# EasyEDA schematic emb_3y_project_2020-11-04_04-35-24.json
TITLE: Sheet_1; REV: 1.0; Date: 2020-10-28; Sheet: 1/1; Drawn By: Praveen Dhananjaya; Company: Your Company
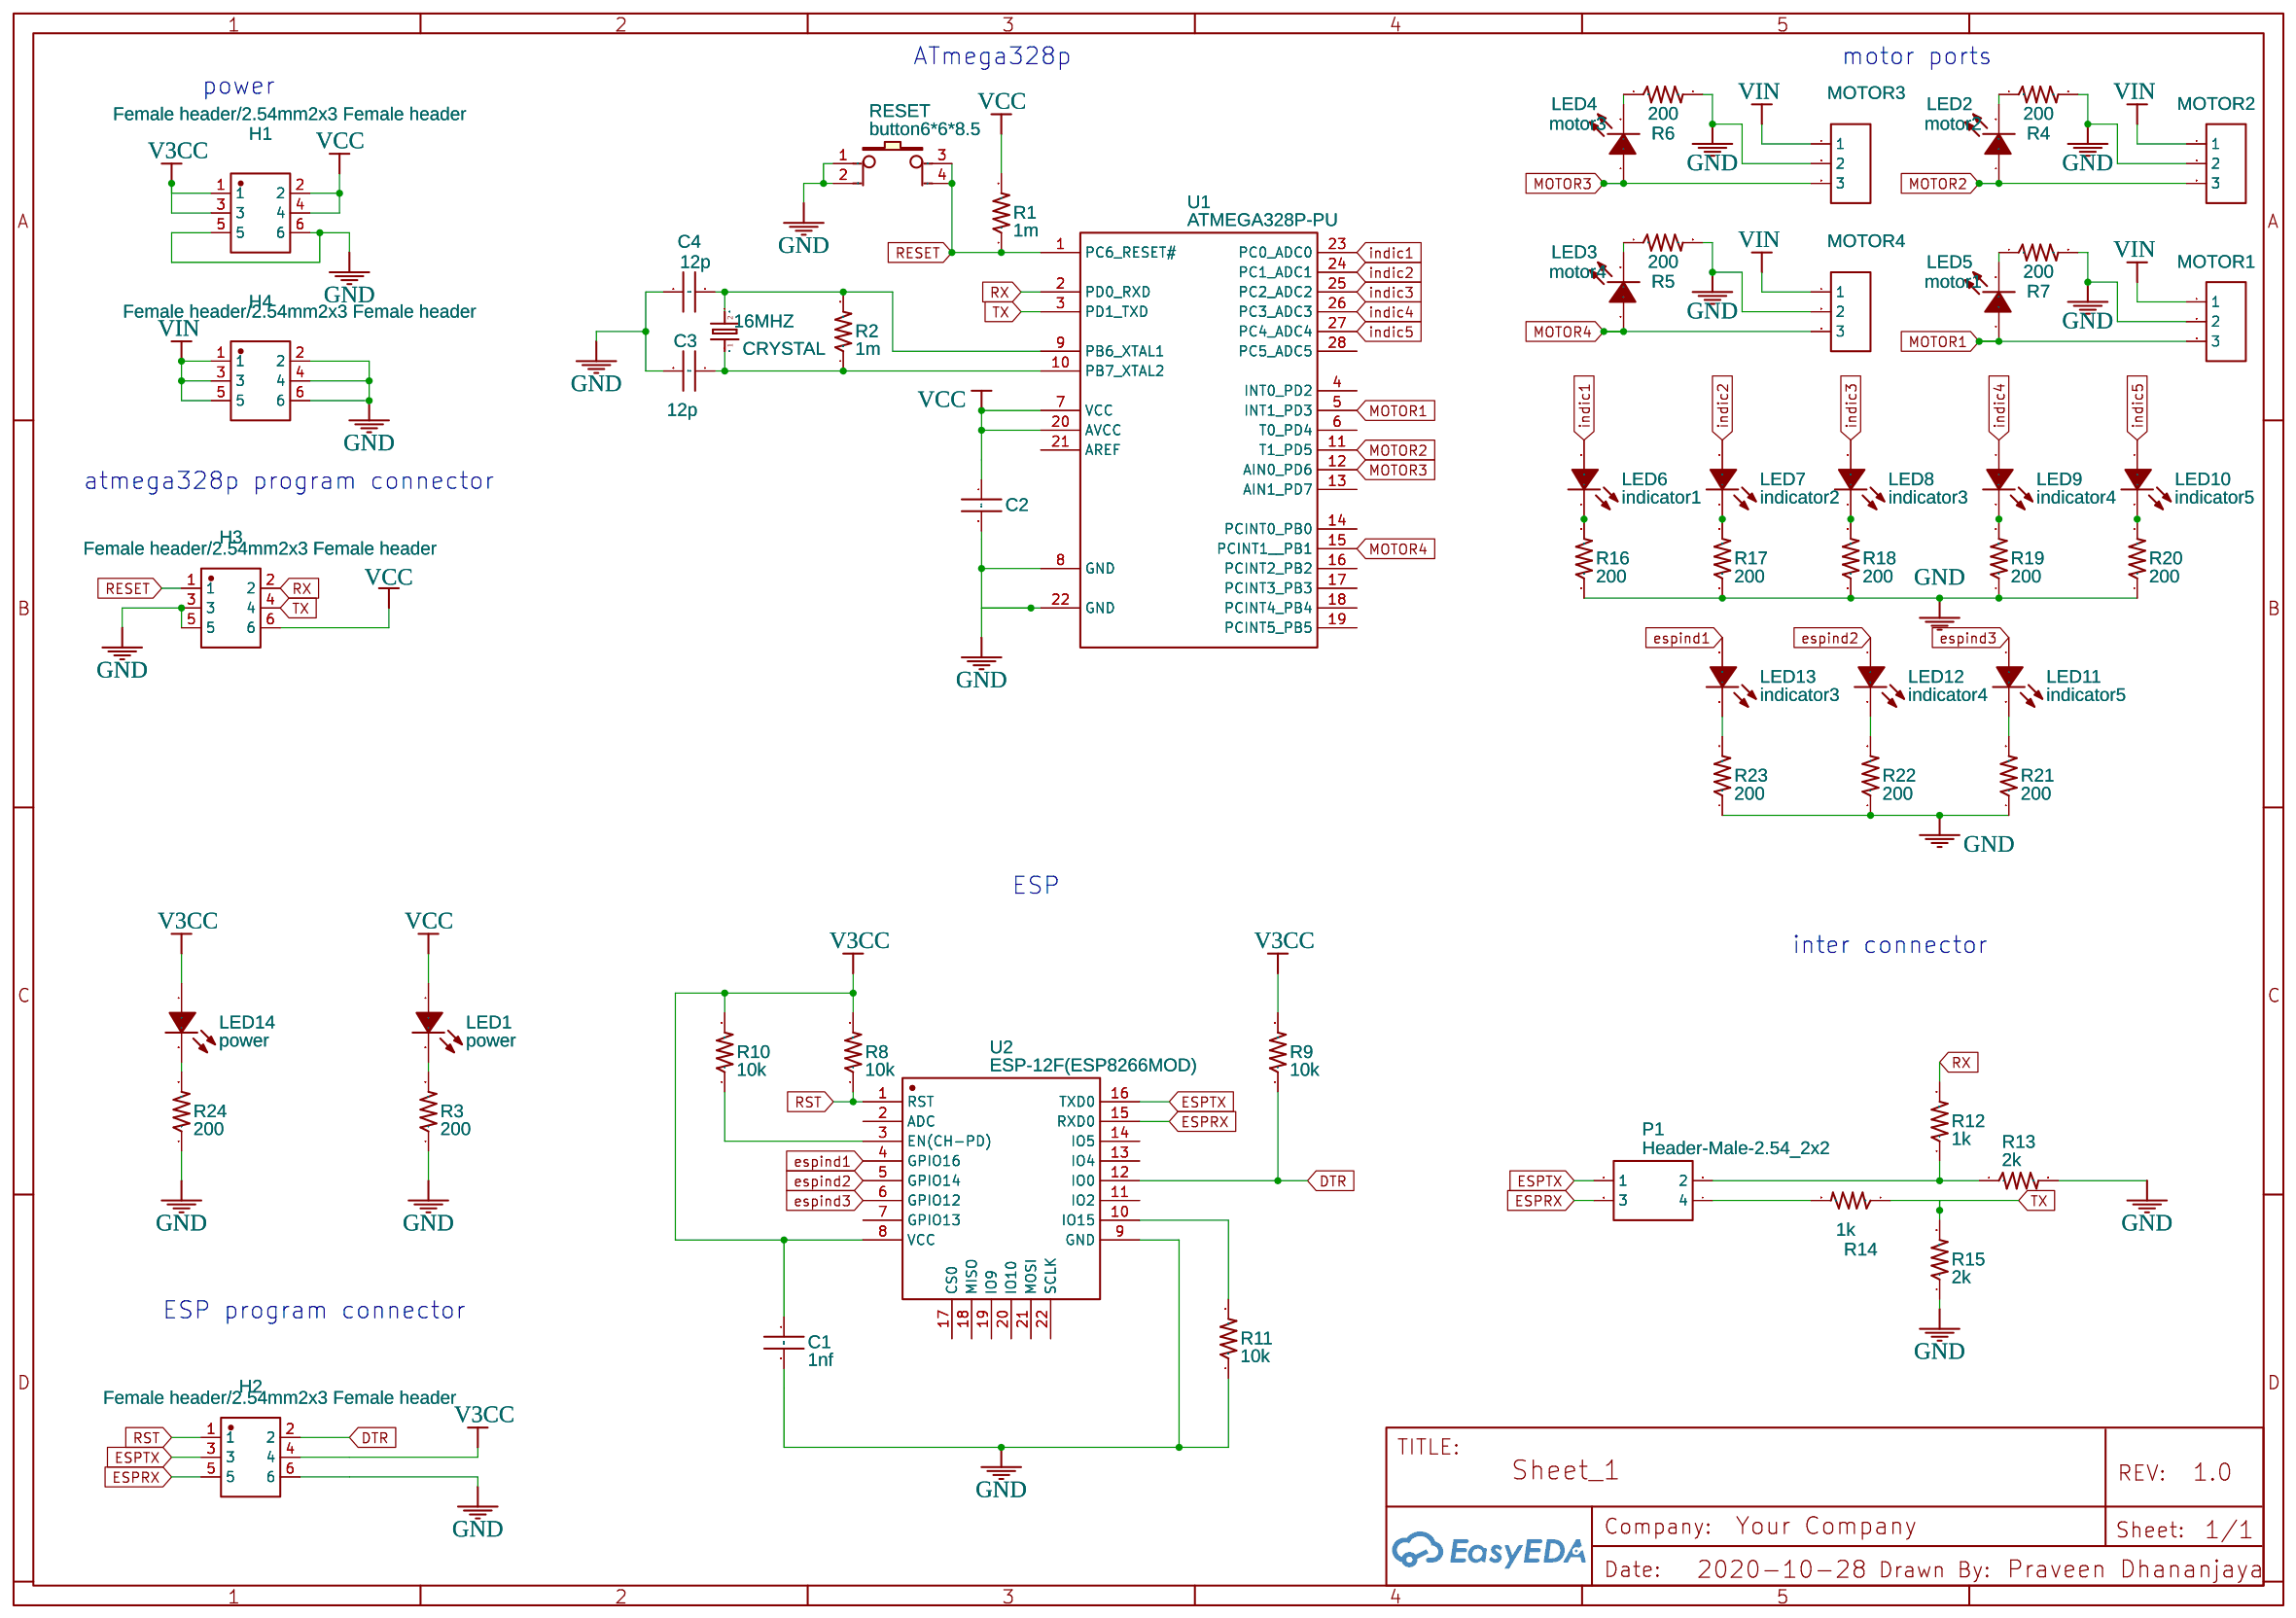
[diagram p0: schematic sheet]

## Parts
16MHZ  CRYSTAL  [HC49US]
C1  1nf  [CAPACITOR (SMT)0805]
C2  12p  [CAPACITOR (SMT)0805]
C3  12p  [CAPACITOR (SMT)0805]
C4  12p  [CAPACITOR (SMT)0805]
H1  Female header/2.54mm2x3 Female header  [HDR-TH_6P-P2.54-V-R2-C3-S2.54]
H2  Female header/2.54mm2x3 Female header  [HDR-TH_6P-P2.54-V-R2-C3-S2.54]
H3  Female header/2.54mm2x3 Female header  [HDR-TH_6P-P2.54-V-R2-C3-S2.54]
H4  Female header/2.54mm2x3 Female header  [HDR-TH_6P-P2.54-V-R2-C3-S2.54]
LED1  power  [LED-TH_BD3.8-P2.54-FD]
LED2  motor2  [LED-TH_BD3.8-P2.54-FD]
LED3  motor4  [LED-TH_BD3.8-P2.54-FD]
LED4  motor3  [LED-TH_BD3.8-P2.54-FD]
LED5  motor1  [LED-TH_BD3.8-P2.54-FD]
LED6  indicator1  [LED-TH_BD3.8-P2.54-FD]
LED7  indicator2  [LED-TH_BD3.8-P2.54-FD]
LED8  indicator3  [LED-TH_BD3.8-P2.54-FD]
LED9  indicator4  [LED-TH_BD3.8-P2.54-FD]
LED10  indicator5  [LED-TH_BD3.8-P2.54-FD]
LED11  indicator5  [LED-TH_BD3.8-P2.54-FD]
LED12  indicator4  [LED-TH_BD3.8-P2.54-FD]
LED13  indicator3  [LED-TH_BD3.8-P2.54-FD]
LED14  power  [LED-TH_BD3.8-P2.54-FD]
MOTOR1  Header-Male-2.54_1x3  [HDR-TH_3P-P2.54-V]
MOTOR2  Header-Male-2.54_1x3  [HDR-TH_3P-P2.54-V]
MOTOR3  Header-Male-2.54_1x3  [HDR-TH_3P-P2.54-V]
MOTOR4  Header-Male-2.54_1x3  [HDR-TH_3P-P2.54-V]
P1  Header-Male-2.54_2x2  [HDR-TH_4P-P2.54-V-R2-C2-S2.54]
R1  1m  [PAK_SMD805]
R2  1m  [PAK_SMD805]
R3  200  [PAK_SMD805]
R4  200  [PAK_SMD805]
R5  200  [PAK_SMD805]
R6  200  [PAK_SMD805]
R7  200  [PAK_SMD805]
R8  10k  [PAK_SMD805]
R9  10k  [PAK_SMD805]
R10  10k  [PAK_SMD805]
R11  10k  [PAK_SMD805]
R12  1k  [PAK_SMD805]
R13  2k  [PAK_SMD805]
R14  1k  [PAK_SMD805]
R15  2k  [PAK_SMD805]
R16  200  [PAK_SMD805]
R17  200  [PAK_SMD805]
R18  200  [PAK_SMD805]
R19  200  [PAK_SMD805]
R20  200  [PAK_SMD805]
R21  200  [PAK_SMD805]
R22  200  [PAK_SMD805]
R23  200  [PAK_SMD805]
R24  200  [PAK_SMD805]
RESET  button6*6*8.5  [KEY-TH_4P-L6.0-W6.0-P4.50]
U1  ATMEGA328P-PU  [DIP-28_L34.6-W7.3-P2.54-LS10.2-BL]
U2  ESP-12F(ESP8266MOD)  [WIFIM-SMD_ESP-12F-ESP8266MOD]

## Library data of the parts
16MHZ = CRYSTAL: Contributor: SparkFun; sourceId: PAyw6e8qI
C1-C4 = CL21C910JBANNNC: Supplier Part: 1276-1836-1-ND; Supplier: Digi-Key; link: http://www.digikey.com/product-detail/en/samsung-electro-mechanics-america-inc/CL21C910JBANNNC/1276-1836-1-ND/3889922; Contributor: thedoctor916
H1-H4 = Female header/2.54mm2x3 Female header: Supplier Part: C47552; Supplier: LCSC; Manufacturer: ReliaPro
LED1-LED14 = LEDOrange orange 3AO4UD: Supplier: LCSC; Manufacturer: KENTO; image: //image.lceda.cn/szlcsc/C62095.jpg; Supplier Part: C62095
MOTOR1-MOTOR4 = Header-Male-2.54_1x3: Supplier: LCSC; Manufacturer: BOOMELE; Manufacturer Part: Header2.54mm 1*3P; image: //image.lceda.cn/szlcsc/C49257.jpg; Supplier Part: C49257
P1 = Header-Male-2.54_2x2: Supplier: LCSC; Manufacturer: BOOMELE; Manufacturer Part: Double Rows2.54mm2*2pHeaders  Pins; Supplier Part: C66690
R1-R24 = R_US805: Manufacturer Part: SAMTECH; link: https://www.mouser.com/ProductDetail/Semtech/TS51224-M000WCSR?qs=sGAEpiMZZMve4%2FbfQkoj%252BOSaK9ndEUJ4S7hJCjD%2FN%252BQ%3D; Contributor: Intector
RESET = button6*6*8.5: Supplier Part: C59980; Supplier: LCSC; Manufacturer: ReliaPro; image: http://image.lceda.cn/szlcsc/C59980.jpg
U1 = ATMEGA328P-PU: sourceId: Oic6oiASL; Supplier: LCSC; Manufacturer: MICROCHIP; image: //image.lceda.cn/szlcsc/C33901.jpg; Contributor: LCSC; Supplier Part: C33901
U2 = ESP-12F(ESP8266MOD): Supplier: LCSC; Manufacturer: Ai-Thinker; Supplier Part: C82891

## Nets
GND: C1.1 C2.2 C3.2 C4.2 H1.5 H1.6 H2.6 H3.3 H3.5 H4.2 H4.4 H4.6 MOTOR1.2 MOTOR2.2 MOTOR3.2 MOTOR4.2 R3.1 R4.2 R5.2 R6.2 R7.2 R11.1 R13.2 R15.1 R16.1 R17.1 R18.1 R19.1 R20.1 R21.1 R22.1 R23.1 R24.1 RESET.1 RESET.2 U1.8(GND) U1.22(GND) U2.9(GND)
V3CC: C1.2 H1.1 H1.3 H2.4 LED14.1(A) R8.2 R9.2 R10.2 U2.8(VCC)
VCC: C2.1 H1.2 H1.4 H3.6 LED1.1(A) R1.2 U1.7(VCC) U1.20(AVCC)
VIN: H4.1 H4.3 H4.5 MOTOR1.1 MOTOR2.1 MOTOR3.1 MOTOR4.1
DTR: H2.2 R9.1 U2.12(IO0)
espind1: LED13.1(A) U2.4(GPIO16)
espind2: LED12.1(A) U2.5(GPIO14)
espind3: LED11.1(A) U2.6(GPIO12)
ESPRX: H2.5 P1.3 U2.15(RXD0)
ESPTX: H2.3 P1.1 U2.16(TXD0)
indic1: LED6.1(A) U1.23(PC0 ADC0)
indic2: LED7.1(A) U1.24(PC1 ADC1)
indic3: LED8.1(A) U1.25(PC2 ADC2)
indic4: LED9.1(A) U1.26(PC3 ADC3)
indic5: LED10.1(A) U1.27(PC4 ADC4)
MOTOR1: LED5.1(A) MOTOR1.3 U1.5(INT1 PD3)
MOTOR2: LED2.1(A) MOTOR2.3 U1.11(T1 PD5)
MOTOR3: LED4.1(A) MOTOR3.3 U1.12(AIN0 PD6)
MOTOR4: LED3.1(A) MOTOR4.3 U1.15(PCINT1  PB1)
RESET: H3.1 R1.1 RESET.3 RESET.4 U1.1(PC6 RESET#)
RST: H2.1 R8.1 U2.1(RST)
RX: H3.2 R12.2 U1.2(PD0 RXD)
TX: H3.4 R14.1 R15.2 U1.3(PD1 TXD)
Net-(16MHZ-1): 16MHZ.1 C3.1 R2.1 U1.10(PB7 XTAL2)
Net-(16MHZ-2): 16MHZ.2 C4.1 R2.2 U1.9(PB6 XTAL1)
Net-(LED1-2): LED1.2(K) R3.2
Net-(LED2-2): LED2.2(K) R4.1
Net-(LED3-2): LED3.2(K) R5.1
Net-(LED4-2): LED4.2(K) R6.1
Net-(LED5-2): LED5.2(K) R7.1
Net-(LED6-2): LED6.2(K) R16.2
Net-(LED7-2): LED7.2(K) R17.2
Net-(LED8-2): LED8.2(K) R18.2
Net-(LED9-2): LED9.2(K) R19.2
Net-(LED10-2): LED10.2(K) R20.2
Net-(LED11-2): LED11.2(K) R21.2
Net-(LED12-2): LED12.2(K) R22.2
Net-(LED13-2): LED13.2(K) R23.2
Net-(LED14-2): LED14.2(K) R24.2
Net-(P1-2): P1.2 R12.1 R13.1
Net-(P1-4): P1.4 R14.2
Net-(R10-1): R10.1 U2.3(EN(CH-PD))
Net-(R11-2): R11.2 U2.10(IO15)

Not connected (* = marked no-connect by the designer): U1 4(INT0 PD2) 6(T0 PD4) 13(AIN1 PD7) 14(PCINT0 PB0) 16(PCINT2 PB2) 17(PCINT3 PB3) 18(PCINT4 PB4) 19(PCINT5 PB5) 21(AREF) 28(PC5 ADC5); U2 2(ADC) 7(GPIO13) 11(IO2) 13(IO4) 14(IO5) 17(CS0) 18(MISO) 19(IO9) 20(IO10) 21(MOSI) 22(SCLK)

## Notes on the sheet
- ATmega328p
- motor ports
- power
- atmega328p program connector
- ESP
- inter connector
- ESP program connector
